# EAGLE design MotorDriver (EAGLE 7.3.0)
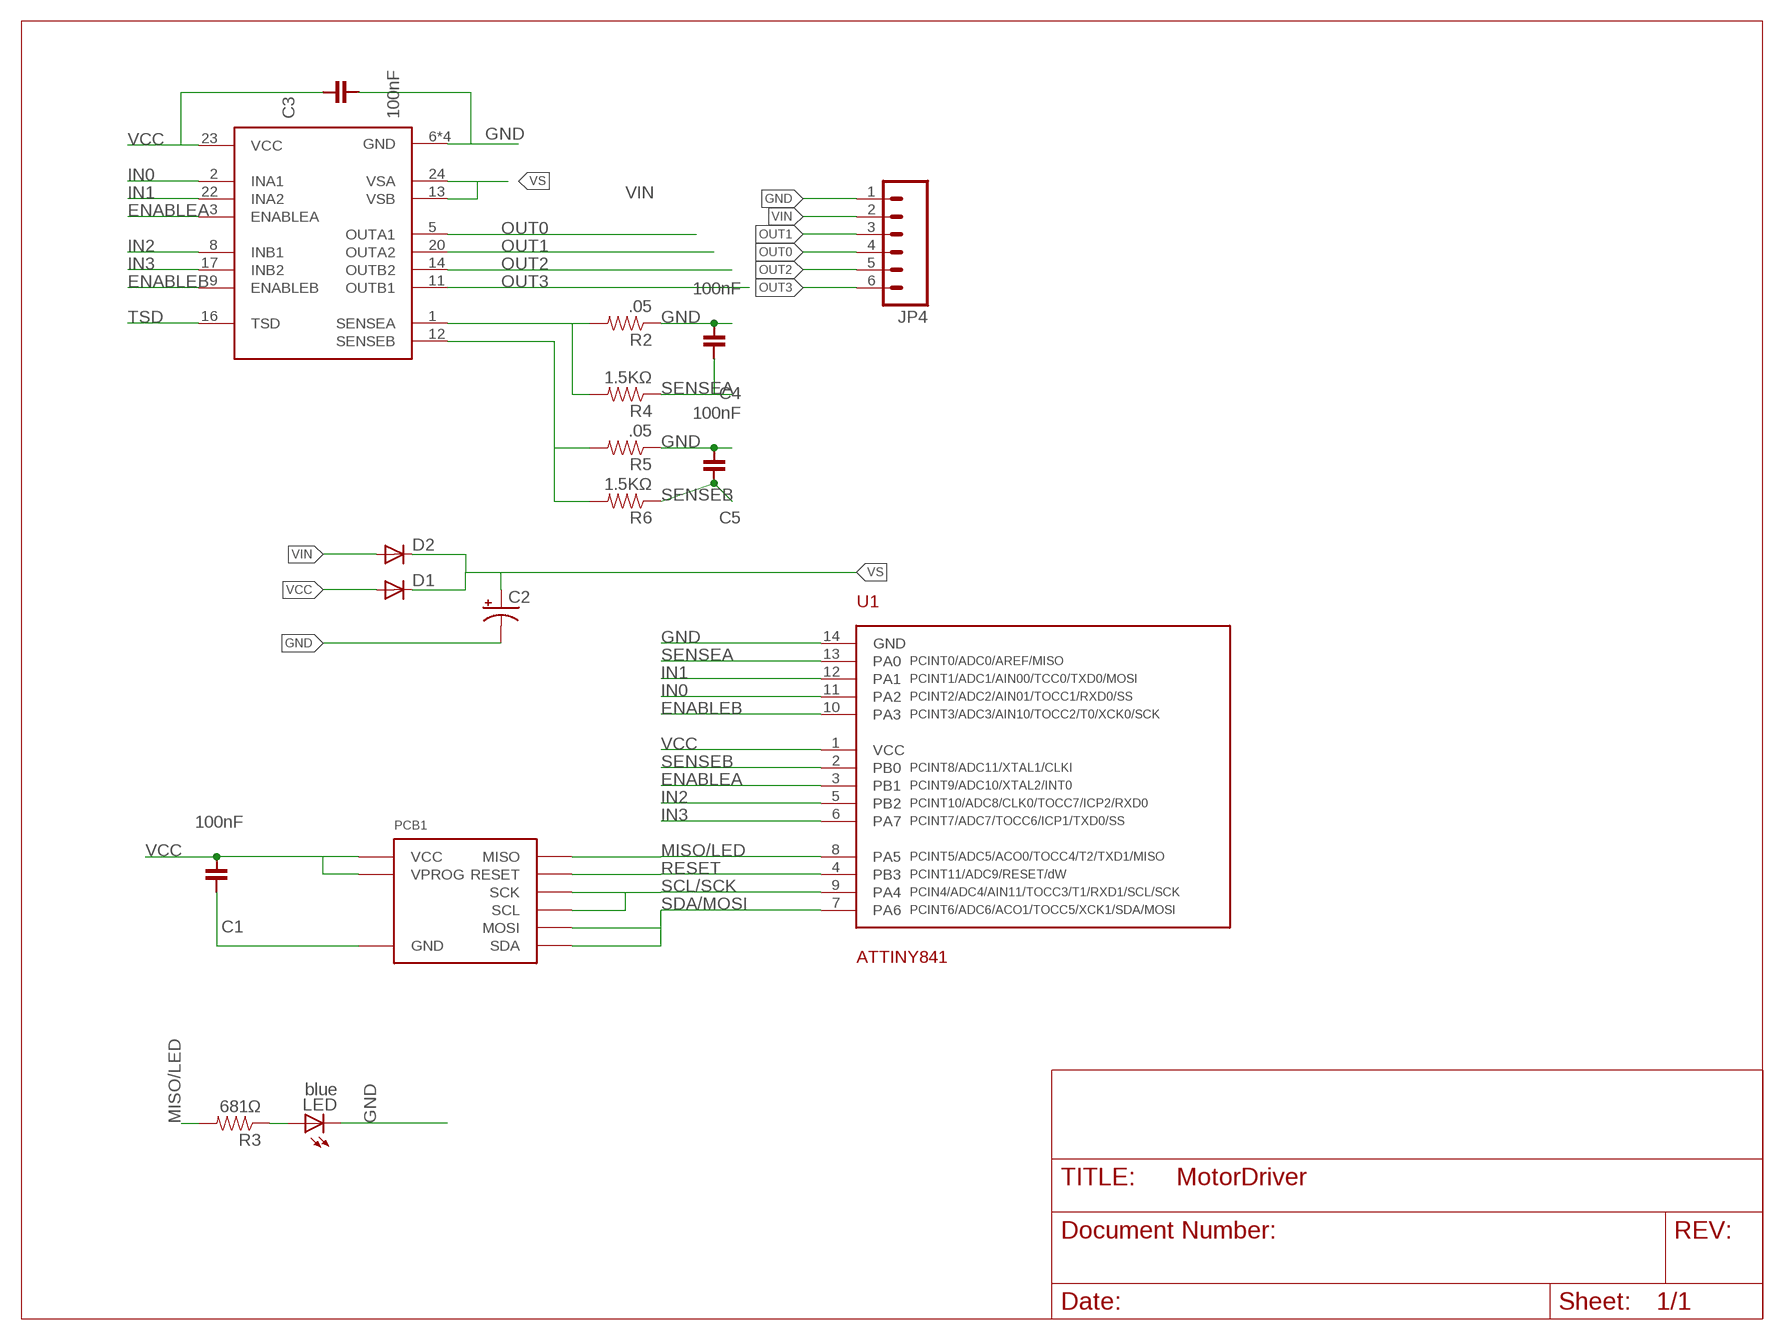
[diagram p0: schematic, sheet 1]

## Parts
C1  100nF  CAPACITOR-100NF  [0603]
C2  CAP_POLC  [PANASONIC_C]
C3  100nF  CAPACITOR-100NF  [0603]
C4  100nF  CAPACITOR-100NF  [0603]
C5  100nF  CAPACITOR-100NF  [0603]
D1  DIODESMA  [SMA-DIODE]
D2  DIODESMA  [SMA-DIODE]
JP4  M063.5MM-6  [SCREWTERMINAL-3.5MM-6]
LED  blue  LED-0805-BLUE  [0805-LED]
PCB1  DEVICE-PCB-TABS  [DEVICE-PCB-TABS]
R2  .05  RESISTOR  [0805]
R3  681Ω  RESISTOR-681Ω  [0603]
R4  1.5KΩ  RESISTOR-1.5KΩ  [0603]
R5  .05  RESISTOR  [0805]
R6  1.5KΩ  RESISTOR-1.5KΩ  [0603]
U1  ATTINY841  [SOIC-14]
U2  NJM2670  [SOP-24-E3]

## Nets
ENABLEA: U1.3(PB1) U2.3(ENABLEA)
ENABLEB: U1.10(PA3) U2.9(ENABLEB)
GND: C1.1 C2.- C3.2 C4.2 C5.2 JP4.1 LED.C PCB1.BUS0(GND) R2.1 R5.1 U1.14(GND) U2.6(GND) U2.7(GND) U2.18(GND) U2.19(GND)
IN0: U1.11(PA2) U2.2(INA1)
IN1: U1.12(PA1) U2.22(INA2)
IN2: U1.5(PB2) U2.8(INB1)
IN3: U1.6(PA7) U2.17(INB2)
MISO/LED: PCB1.PROG3(MISO) R3.2 U1.8(PA5)
N$2: R2.2 R4.2 U2.1(SENSEA)
N$3: R5.2 R6.2 U2.12(SENSEB)
N$5: LED.A R3.1
OUT0: JP4.4 U2.5(OUTA1)
OUT1: JP4.3 U2.20(OUTA2)
OUT2: JP4.5 U2.14(OUTB2)
OUT3: JP4.6 U2.11(OUTB1)
RESET: PCB1.PROG1(RESET) U1.4(PB3)
SCL/SCK: PCB1.BUS3(SCL) PCB1.PROG2(SCK) U1.9(PA4)
SDA/MOSI: PCB1.BUS1(SDA) PCB1.PROG4(MOSI) U1.7(PA6)
SENSEA: C4.1 R4.1 U1.13(PA0)
SENSEB: C5.1 R6.1 U1.2(PB0)
TSD: U2.16(TSD)
VCC: C1.2 C3.1 D1.A PCB1.BUS2(VCC) PCB1.PROG0(VPROG) U1.1(VCC) U2.23(VCC)
VIN: D2.A JP4.2
VS: C2.+ D1.C D2.C U2.13(VSB) U2.24(VSA)

## Library data of the parts
C1 C3-C5 = Modulo:CAPACITOR: Capacitor; PARTNUM: C0603C104K5RACTU
C2 = SparkFun-Capacitors:CAP_POL: Capacitor Polarized These are standard SMD and PTH capacitors. Normally 10uF, 47uF, and 100uF in electrolytic and tantalum varieties. Always verify the external diameter of the through hole cap, it varies with capacity, voltage, and manufacturer. The EIA devices should be standard.; PARTNUM: EEE-0JA101WR
D1 D2 = SparkFun-DiscreteSemi:DIODE: Diode These are standard reverse protection diodes and small signal diodes. SMA package can handle up to about 1A. SOD-323 can handle about 200mA. What the SOD-323 package when ordering, there are some mfgs out there that are 5-pin packages.; PARTNUM: SSA33L-E3/61T
JP4 = SparkFun-Connectors:M06: Header 6 Standard 6-pin 0.1" header. Use with straight break away headers (SKU : PRT-00116), right angle break away headers (PRT-00553), swiss pins (PRT-00743), machine pins (PRT-00117), and female headers (PRT-00115). Molex polarized connector foot print use with SKU : PRT-08094 with associated crimp pins and housings. NOTES ON THE VARIANTS LOCK and LOCK_LONGPADS... This footprint was designed to help hold the alignment of a through-hole component (i.e. 6-pin header) while soldering it into place. You may notice that each hole has been shifted either up or down by 0.005 of an inch from it's more standard position (which is a perfectly straight line). This slight alteration caused the pins (the squares in the middle) to touch the edges of the holes. Because they are alternating, it causes a "brace" to hold the component in place. 0.005 has proven to be the perfect amount of "off-center" position when using our standard breakaway headers. Although looks a little odd when you look at the bare footprint, once you have a header in there, the alteration is very hard to notice. Also,if you push a header all the way into place, it is covered up entirely on the bottom side. This idea of altering the position of holes to aid alignment will be further integrated into the Sparkfun Library for other footprints. It can help hold any component with 3 or more connection pins.; PARTNUM: OSTTE060104
LED = Modulo:LED: LED; PARTNUM: LTST-C171TBKT
PCB1 = Modulo:DEVICE-PCB: Modulo Footprint
R2 R5 = Modulo:RESISTOR: Resistor Basic schematic elements and footprints for 0603, 1206, and PTH resistors.; PARTNUM: CSR0805FKR500
R3 = Modulo:RESISTOR: Resistor Basic schematic elements and footprints for 0603, 1206, and PTH resistors.; PARTNUM: ERJ-3EKF6810V
R4 R6 = Modulo:RESISTOR: Resistor Basic schematic elements and footprints for 0603, 1206, and PTH resistors.; PARTNUM: ERJ-3EKF1501V
U1 = Modulo:ATTINY841; PARTNUM: ATTINY841-SSUR
U2 = IntegerLabs:NJM2670; PARTNUM: NJM2670E3

## Board
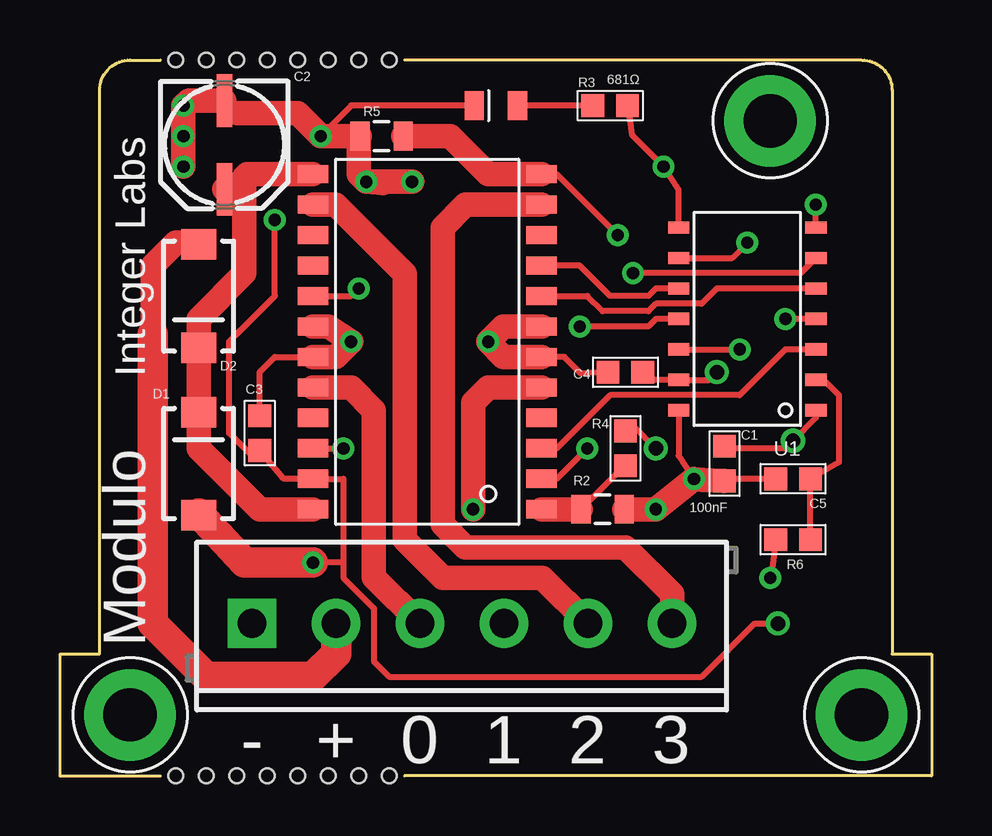
[diagram p1: board, top side]
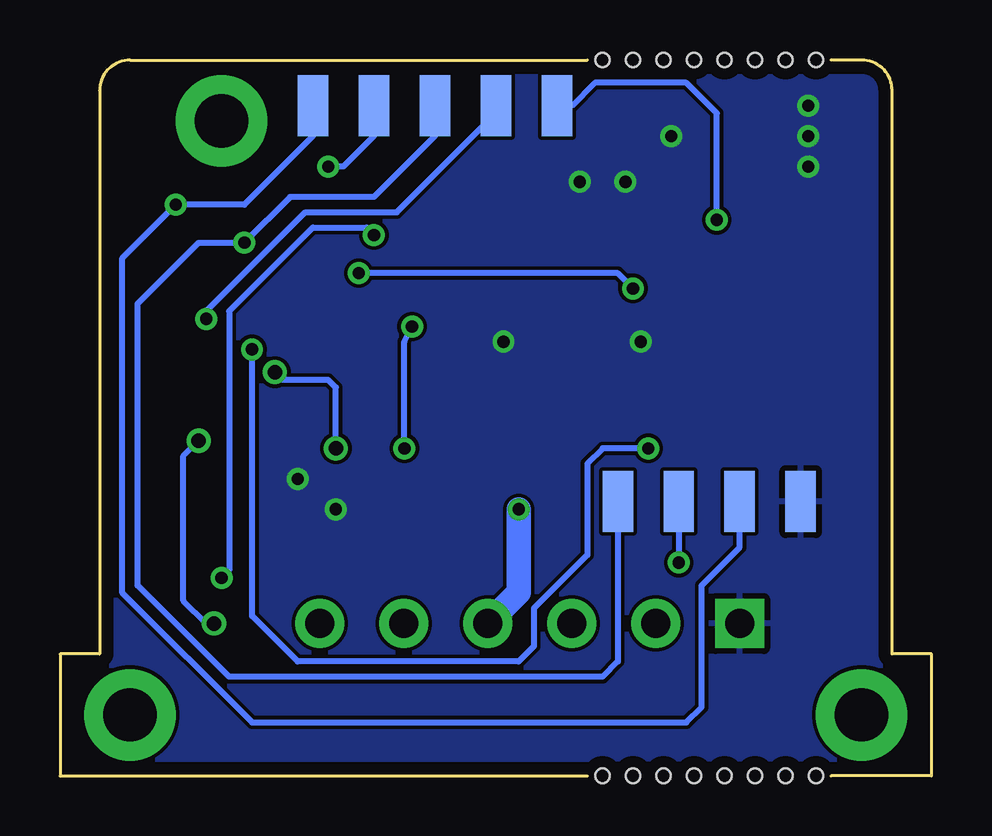
[diagram p2: board, bottom side, seen from below]

Size 36.32 x 29.84 mm. Coordinates in mm from the lower left corner, seen from the top.
Copper layers (1*16): Top 0.0178mm / dielectric 59mil / Bottom 0.0178mm
Design rules "SSC-EAGLE-2Lyr_v1.0.0.3": minimum track width 6mil, minimum drill 14mil, track to track 6mil, track to pad 6mil, pad to pad 6mil, via to via 6mil, smd to smd 6mil, copper to edge 20mil, drill to drill 16mil, minimum pad ring 8mil, minimum via ring 8mil, stop-mask expansion 3mil, vias tented up to drill 0mil, thermal gap 10mil

### Footprints (pad centres in the part's own frame; a part is rotated, then mirrored left to right if it is on the bottom)
0603 = smd 0.95 x 0.95: 1 -0.725,0; 2 0.725,0
PANASONIC_C = smd 2.2 x 0.65: + 1.9,-0.2; - -1.8,-0.2
SMA-DIODE = smd 1.27 x 1.47: A -2.15,0; C 2.15,0
SCREWTERMINAL-3.5MM-6 = drill 1.2 pad 2.032 square: 1 0,0 | drill 1.2 pad 2.032: 2 3.5,0; 3 7,0; 4 10.5,0; 5 14,0; 6 17.5,0
0805-LED = smd 1.2 x 0.8: A 0,-0.9; C 0,0.9
DEVICE-PCB-TABS = smd 1.27 x 2.54 bottom: BUS0 5.08,11.43; BUS1 7.62,11.43; BUS2 10.16,11.43; BUS3 12.7,11.43; PROG0 15.24,27.94; PROG1 17.78,27.94; PROG2 20.32,27.94; PROG3 22.86,27.94; PROG4 25.4,27.94 | drill 2.223 pad 3.81: P$1 2.54,2.54; P$2 33.02,2.54; P$3 29.21,27.305 | hole 0.6: 4.445,29.845; 5.715,29.845; 6.985,29.845; 8.255,29.845; 9.525,29.845; 10.795,29.845; 12.065,29.845; 13.335,29.845; 4.445,0; 5.715,0; 6.985,0; 8.255,0; 9.525,0; 10.795,0; 12.065,0; 13.335,0
0805 = smd 0.8 x 1.2: 1 -0.9,0; 2 0.9,0
SOIC-14 = smd 0.508 x 0.889: 1 0,-3.175; 2 1.27,-3.175; 3 2.54,-3.175; 4 3.81,-3.175; 5 5.08,-3.175; 6 6.35,-3.175; 7 7.62,-3.175; 8 7.62,2.54; 9 6.35,2.54; 10 5.08,2.54; 11 3.81,2.54; 12 2.54,2.54; 13 1.27,2.54; 14 0,2.54
SOP-24-E3 = smd 0.762 x 1.27: 1 -6.35,-4.445; 2 -5.08,-4.445; 3 -3.81,-4.445; 4 -2.54,-4.445; 5 -1.27,-4.445; 6 0,-4.445; 7 1.27,-4.445; 8 2.54,-4.445; 9 3.81,-4.445; 10 5.08,-4.445; 11 6.35,-4.445; 12 7.62,-4.445; 13 7.62,5.08; 14 6.35,5.08; 15 5.08,5.08; 16 3.81,5.08; 17 2.54,5.08; 18 1.27,5.08; 19 0,5.08; 20 -1.27,5.08; 21 -2.54,5.08; 22 -3.81,5.08; 23 -5.08,5.08; 24 -6.35,5.08

### Placement (x,y rotation side)
C1  27.69,13.02 90 top
C2  7.05,26.35 270 top
C3  8.32,14.29 90 top
C4  23.56,16.83 180 top
C5  30.54,12.38 180 top
D1  5.78,13.02 90 top
D2  5.78,20 270 top
JP4  8,6.35 0 top
LED  18.16,27.94 90 top
PCB1  0.38,0 0 top
R2  22.61,11.11 180 top
R3  22.92,27.94 0 top
R4  23.56,13.65 270 top
R5  13.4,26.67 0 top
R6  30.54,9.84 180 top
U1  28.32,15.24 90 top
U2  15.62,17.46 90 top

### Tracks (layer width: path | path; a pad name or v marks a point on that pad's centre or on a via)
ENABLEA
  Top 0.254: U1.3 30.23,17.78 28.32,15.88 22.92,15.88 20.7,13.65 U2.3
ENABLEB
  Top 0.254: U1.10 24.83,20.32 24.51,20 22.92,20 21.65,21.27 U2.9
GND  (via drill 0.51)
  Top 0.254: LED.C 12.13,27.94 v10.86,26.67 | U2.7 20.38,18.73 | C3.2 8.32,16.83 8.95,17.46 U2.19 | C4.2 21.71,16.77 21.02,17.46 U2.6 | C5.2 27.74,12.38 C1.1 | U1.14 25.78,13.34 v26.42,12.38
  Top 1.016: R2.1 v24.83,11.11 v26.42,12.38 26.79,12.33 C1.1 | U2.19 11.49,17.46 v12.13,18.1 11.18,18.73 U2.18 | U2.7 18.48,18.73 v17.84,18.1 18.48,17.46 U2.6 | 7.38,27.62 9.91,27.62 v10.86,26.67 12.45,26.67 | 13.45,24.71 v12.76,24.77 | v12.76,24.77 12.45,25.08 12.45,26.67 | v12.76,24.77 v14.67,24.77 | C2.- 5.36,28.15 v5.14,27.94 v5.14,26.67 v5.14,25.4 | R5.1 12.45,26.67
  pour Bottom: -0.89,0 -0.89,30.48 37.21,30.48 37.21,0
IN0  (via drill 0.51)
  Top 0.254: U2.2 20.7,12.38 v21.97,13.65 | U1.11 24.83,19.05 24.51,18.73 v21.65,18.73
  Bottom 0.254: v21.97,13.65 21.97,18.1 v21.65,18.73
IN1  (via drill 0.51)
  Top 0.254: U2.22 v11.81,13.65 | U1.12 v28.32,17.78
  Bottom 0.254: v11.81,13.65 13.72,13.65 14.35,13.02 14.35,9.21 16.57,6.99 16.57,5.4 17.21,4.76 26.42,4.76 28.32,6.67 v28.32,17.78
IN2
  Top 0.254: U2.8 21.97,20 22.61,19.37 24.51,19.37 24.83,19.68 26.73,19.68 27.37,20.32 U1.5
IN3  (via drill 0.51)
  Top 0.254: U2.17 12.13,20 v12.45,20.32 | U1.6 30.86,20.95 v23.88,20.95
  Bottom 0.254: v12.45,20.32 13.08,20.95 v23.88,20.95
MISO/LED  (via drill 0.51)
  Top 0.254: R3.2 23.82,26.72 v25.15,25.4 25.78,24.45 U1.8
  Bottom 0.254: PCB1.PROG3 23.24,26.67 24.51,25.4 v25.15,25.4
N$2
  Top 0.254: R4.2 23.56,12.7 23.29,12.65 23.29,12.7 R2.2
  Top 1.016: U2.1 R2.2
N$3  (via drill 0.51)
  Top 0.254: U2.12 20.7,25.08 v23.24,22.54 | R6.2 29.64,8.31 v29.59,8.26
  Top 1.016: U2.12 17.84,25.08 16.26,26.67 R5.2
  Bottom 0.254: v23.24,22.54 23.56,22.86 25.78,22.86 29.27,19.37 29.27,8.57 v29.59,8.26
N$5
  Top 0.254: R3.1 LED.A
OUT0  (via drill 0.51)
  Top 1.016: U2.5 17.84,16.19 17.21,15.56 v17.21,11.11
  Bottom 1.016: v17.21,11.11 17.21,7.64 JP4.4
OUT1
  Top 1.016: U2.20 12.13,16.19 13.08,15.24 13.08,8.27 JP4.3
OUT2
  Top 1.016: U2.14 11.49,23.81 14.37,20.94 14.37,9.83 15.94,8.26 20.1,8.26 JP4.5
OUT3
  Top 1.016: U2.11 16.89,23.81 15.94,22.86 15.94,10.48 16.89,9.53 23.56,9.53 25.5,7.58 JP4.6
RESET  (via drill 0.51)
  Top 0.254: U1.4 31.18,19.05 v30.23,19.05
  Bottom 0.254: PCB1.PROG1 18.16,27.62 22.29,23.5 26.1,23.5 30.23,19.37 v30.23,19.05
SCL/SCK  (via drill 0.51)
  Top 0.254: U1.9 28,21.59 v28.64,22.23
  Bottom 0.254: PCB1.BUS3 13.08,11.11 | PCB1.BUS3 13.08,11.75 | PCB1.BUS3 13.08,4.76 13.72,4.13 29.27,4.13 33.08,7.94 33.08,19.68 30.54,22.23 v28.64,22.23 26.73,24.13 23.24,24.13 20.7,26.67 PCB1.PROG2
SDA/MOSI  (via drill 0.51)
  Top 0.254: U1.7 v31.5,23.81
  Bottom 0.254: PCB1.BUS1 8,9.53 9.59,7.94 9.59,2.86 10.22,2.22 28.32,2.22 33.72,7.62 33.72,21.59 v31.5,23.81 28.64,23.81 25.78,26.67 PCB1.PROG4
SENSEA  (via drill 0.6)
  Top 0.254: R4.1 23.56,14.61 23.88,14.61 v24.83,13.65 | 24.51,16.77 C4.1 24.78,16.51 U1.13 27.05,16.51 v27.37,16.83
  Bottom 0.254: v24.83,13.65 24.83,16.19 25.15,16.51 27.05,16.51 v27.37,16.83
SENSEB
  Top 0.254: R6.1 C5.1 32.45,13.07 32.45,15.88 31.81,16.51 U1.2
VCC  (via drill 0.51, 0.6)
  Top 0.254: 11.81,8.89 11.81,12.38 U2.23 9.32,12.38 C3.1 7.95,13.39 7.05,14.29 7.05,18.1 8.95,20 v8.95,23.18 | 11.81,8.89 v10.54,8.89 | 11.81,8.89 11.81,8.26 13.08,6.99 13.08,4.76 13.72,4.13 26.73,4.13 28.96,6.35 v29.91,6.35 | U1.1 31.5,14.92 v30.54,13.97 30.23,13.65 28.09,13.65 C1.2
  Top 1.016: 5.78,10.94 5.85,10.94 D1.A
  Top 1.27: v10.54,8.89 7.68,8.89 5.78,10.94
  Bottom 0.254: v8.95,23.18 8.95,27.62 10.22,28.89 14.03,28.89 14.99,27.94 PCB1.PROG0 | U2.23 PCB1.BUS2 v10.54,8.89 | v29.91,6.35 30.23,6.35 31.18,7.3 31.18,13.34 v30.54,13.97
VIN
  Top 1.016: 3.87,18.41 3.87,21.27 4.83,22.23 5.71,22.23 D2.A
  Top 1.27: JP4.2 11.5,5.09 10.54,4.13 6.1,4.13 3.87,6.35 3.87,18.41
VS
  Top 1.016: U2.24 8.32,11.11 5.78,13.65 D1.C D2.C 5.78,19.05 7.68,20.95 7.68,24.45 | 7.68,24.45 7.68,24.97 7.8,25.08 U2.13 | C2.+ 7.68,24.45

### Text on the board
tNames: - | + | 0 | 1 | 2 | 3